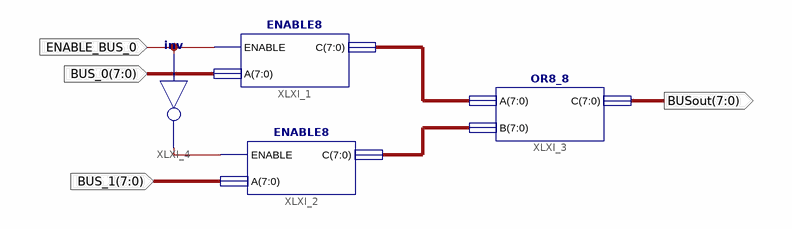
[diagram p0: schematic sheet 1]
// Xilinx ISE schematic BUS_SELECT.sch (spartan3) as structural Verilog: 4 symbols, 4 ports
module BUS_SELECT (
  input  [7:0] BUS_0,
  input  [7:0] BUS_1,
  input  ENABLE_BUS_0,
  output [7:0] BUSout
);

  wire XLXN_7;
  wire [7:0] XLXN_4, XLXN_5;

  ENABLE8 XLXI_1 (.ENABLE(ENABLE_BUS_0), .A(BUS_0), .C(XLXN_4));
  ENABLE8 XLXI_2 (.ENABLE(XLXN_7), .A(BUS_1), .C(XLXN_5));
  OR8_8 XLXI_3 (.A(XLXN_4), .B(XLXN_5), .C(BUSout));
  not XLXI_4 (XLXN_7, ENABLE_BUS_0);
endmodule
